# Altium schematic sheet SoC_GTR.SchDoc: RFSOC_AMC
size 420 x 297 mm; Author: G.Kasprowicz; CompanyName: WUT ISE; DrawnBy: G.Kasprowicz; Organization: WUT ISE; Address1: PW ISE; Address2: Nowowiejska 15/19 00-665 Warsaw; Address3: gkasprow@gmail.com; DocumentNumber: 37; Revision: 2; SheetNumber: 37; SheetTotal: 54; ModifiedBy: -; CheckedDate: -; Title2: 8 channel ADC & DAC; DivGrp: WUT ISE; Designer: G.Kasprowicz; ModifiedDate: -; ProjectName: Sensor Box
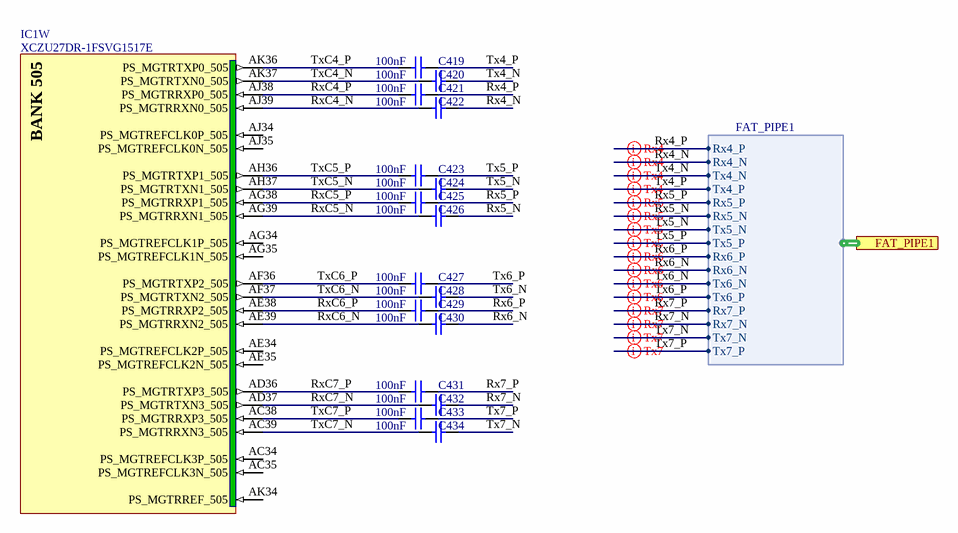
[diagram p0: SoC_GTR.SchDoc]

## Parts
C419  100nF  [CAPC0603X33N]
C420  100nF  [CAPC0603X33N]
C421  100nF  [CAPC0603X33N]
C422  100nF  [CAPC0603X33N]
C423  100nF  [CAPC0603X33N]
C424  100nF  [CAPC0603X33N]
C425  100nF  [CAPC0603X33N]
C426  100nF  [CAPC0603X33N]
C427  100nF  [CAPC0603X33N]
C428  100nF  [CAPC0603X33N]
C429  100nF  [CAPC0603X33N]
C430  100nF  [CAPC0603X33N]
C431  100nF  [CAPC0603X33N]
C432  100nF  [CAPC0603X33N]
C433  100nF  [CAPC0603X33N]
C434  100nF  [CAPC0603X33N]
IC1  XCZU27DR-1FSVG1517E  [XILINX_FSVG1517 (XCZU27DR)]  (part W of 31)

## Ports
FAT_PIPE1 (harness FAT_PIPE1)

## Harnesses
FAT_PIPE1: Rx4_P, Rx4_N, Tx4_N, Tx4_P, Rx5_P, Rx5_N, Tx5_N, Tx5_P, Rx6_P, Rx6_N, Tx6_N, Tx6_P, Rx7_P, Rx7_N, Tx7_N, Tx7_P

## Nets
Rx4_N: C422.2 ; port FAT_PIPE1.Rx4_N
Rx4_P: C421.2 ; port FAT_PIPE1.Rx4_P
Rx5_N: C426.2 ; port FAT_PIPE1.Rx5_N
Rx5_P: C425.2 ; port FAT_PIPE1.Rx5_P
Rx6_N: C430.2 ; port FAT_PIPE1.Rx6_N
Rx6_P: C429.2 ; port FAT_PIPE1.Rx6_P
Rx7_N: C432.2 ; port FAT_PIPE1.Rx7_N
Rx7_P: C431.2 ; port FAT_PIPE1.Rx7_P
RxC4_N: C422.1 IC1.AJ39(PS_MGTRRXN0_505)
RxC4_P: C421.1 IC1.AJ38(PS_MGTRRXP0_505)
RxC5_N: C426.1 IC1.AG39(PS_MGTRRXN1_505)
RxC5_P: C425.1 IC1.AG38(PS_MGTRRXP1_505)
RxC6_N: C430.1 IC1.AE39(PS_MGTRRXN2_505)
RxC6_P: C429.1 IC1.AE38(PS_MGTRRXP2_505)
RxC7_N: C432.1 IC1.AD37(PS_MGTRTXN3_505)
RxC7_P: C431.1 IC1.AD36(PS_MGTRTXP3_505)
Tx4_N: C420.2 ; port FAT_PIPE1.Tx4_N
Tx4_P: C419.2 ; port FAT_PIPE1.Tx4_P
Tx5_N: C424.2 ; port FAT_PIPE1.Tx5_N
Tx5_P: C423.2 ; port FAT_PIPE1.Tx5_P
Tx6_N: C428.2 ; port FAT_PIPE1.Tx6_N
Tx6_P: C427.2 ; port FAT_PIPE1.Tx6_P
Tx7_N: C434.2 ; port FAT_PIPE1.Tx7_N
Tx7_P: C433.2 ; port FAT_PIPE1.Tx7_P
TxC4_N: C420.1 IC1.AK37(PS_MGTRTXN0_505)
TxC4_P: C419.1 IC1.AK36(PS_MGTRTXP0_505)
TxC5_N: C424.1 IC1.AH37(PS_MGTRTXN1_505)
TxC5_P: C423.1 IC1.AH36(PS_MGTRTXP1_505)
TxC6_N: C428.1 IC1.AF37(PS_MGTRTXN2_505)
TxC6_P: C427.1 IC1.AF36(PS_MGTRTXP2_505)
TxC7_N: C434.1 IC1.AC39(PS_MGTRRXN3_505)
TxC7_P: C433.1 IC1.AC38(PS_MGTRRXP3_505)

Not connected (* = marked no-connect by the designer): IC1 AC34(PS_MGTREFCLK3P_505) AC35(PS_MGTREFCLK3N_505) AE34(PS_MGTREFCLK2P_505) AE35(PS_MGTREFCLK2N_505) AG34(PS_MGTREFCLK1P_505) AG35(PS_MGTREFCLK1N_505) AJ34(PS_MGTREFCLK0P_505) AJ35(PS_MGTREFCLK0N_505) AK34(PS_MGTRREF_505)

## Layout directives
differential pair: Rx4_N, Rx4_P, Rx5_N, Rx5_P, Rx6_N, Rx6_P, Rx7_N, Rx7_P, Tx4_N, Tx4_P, Tx5_N, Tx5_P, Tx6_N, Tx6_P, Tx7_N, Tx7_P

## Notes on the sheet
- Project/Equipment
- Document
- Designer
- Drawn by
- Check.by
- Copyright WUT ISE 2019.
  This documentation describes Open Hardware and is licensed under the CERN OHL v.1.1. You may redistribute and modify this documentation under the terms of the CERN OHL v.1.1. (http://ohwr.org/CERNOHL). This documentation is distributed WITHOUT ANY EXPRESS OR IMPLIED WARRANTY, INCLUDING OF MERCHANTABILITY, SATISFACTORY QUALITY AND FITNESS FOR A PARTICULAR PURPOSE. Please see the CERN OHL v.1.1 for applicable conditions.
- Contact
- File
- Last Mod.
- Print Date
- Sheet
- Size
- A3
- of
- Rev
- (in symbol XCZU27DR-1FSVG1517E, part W) BANK 505

## Library data of the parts
C419-C434 = CC0201_100NF_6.3V_10%_X5R: Non-polarised capacitor; Part Description: SMD Multilayer Chip Ceramic Capacitor; Manufacturer: GENERIC; Manufacturer1 Part Number: 02016D104KAT2A; Voltage: 6.3V; TC: X5R; Tolerance: ±10%; Part Number: CC0201_100NF_6.3V_10%_X5R; Component Kind: Standard; Component Type: Standard; Pin Count: 2; Value: 100nF; Status: Not Recommended; Manufacturer Part Number: CC0201_100NF_6.3V_10%_X5R; Case: 0201; Mounted: Yes; Socket: No; SMD: Yes; Sense: No; Manufacturer1 Example: AVX; Manufacturer1 ComponentHeight: 0.33mm; HelpURL: \\cern.ch\dfs\Applications\Altium\Datasheets\CC0201_X5R_AVX.pdf; Author: CERN DEM JLC; CreateDate: 03/12/2007; LatestRevisionDate: 03/12/2007
IC1 = XCZU27DR-1FSVG1517E: Zynq UltraScale+ RFSoC, Quad-Core ARM® Cortex™-A53 MPCore™ up to 1.5GHz, 214 PS I/O, 299 HP I/O, 48 HD I/O, 1517-Pin BGA; Manufacturer: XILINX; PressFit: No; Bonding: No; Part Number: XCZU27DR-1FSVG1517E; Component Kind: Standard; Component Type: Standard; Device: XCZU27DR-1FSVG1517E; PackageDescription: BGA, 1.00mm Pitch, Square; 1517 Pin, 39 Columns X 39 Rows, 40.00mm X 40.00mm X 4.01mm H; Part Description: Zynq UltraScale+ RFSoC, Quad-Core ARM® Cortex™-A53 MPCore™ up to 1.5GHz, 214 PS I/O, 299 HP I/O, 48 HD I/O, 1517-Pin BGA; Manufacturer Part Number: XCZU27DR-1FSVG1517E; Pin Count: 1517; Case: BGA1517; Mounted: Yes; Socket: No; SMD: Yes; Sense: No; ComponentHeight: 4.01mm; HelpURL: \\cern.ch\dfs\Applications\Altium\Datasheets\XCZU27DR-1FSVG1517E.pdf; ComponentLink1URL: \\cern.ch\dfs\Applications\Altium\Datasheets\XCZU27DR-1FSVG1517E_Package-Pinout.pdf; ComponentLink1Description: Package/Pinout; ComponentLink2URL: \\cern.ch\dfs\Applications\Altium\Datasheets\XCZU27DR-1FSVG1517E_Pinout.pdf; ComponentLink2Description: Pinout; Author: CERN DEM MR; CreateDate: 02/05/2018; LatestRevisionDate: 02/05/2018